# Altium schematic sheet Sheet1.SchDoc
size A
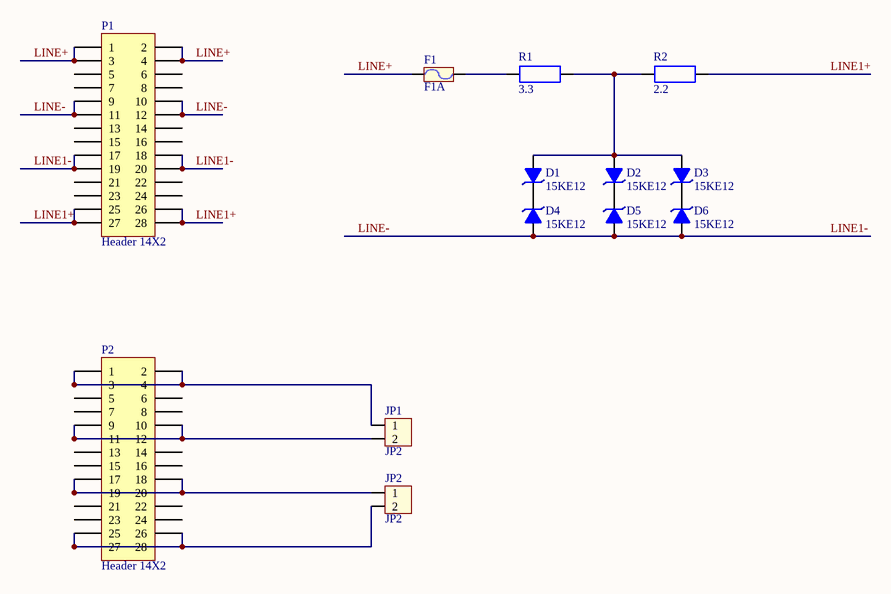
[diagram p0: Sheet1.SchDoc]

## Parts
D1  15KE12  [D1A]
D2  15KE12  [D1A]
D3  15KE12  [D1A]
D4  15KE12  [D1A]
D5  15KE12  [D1A]
D6  15KE12  [D1A]
F1  F1A  [Fuse]
JP1  JP2  [CON2]
JP2  JP2  [CON2]
P1  Header 14X2  [HDR2X14]
P2  Header 14X2  [HDR2X14]
R1  3.3  [R2W]
R2  2.2  [R2W]

## Nets
LINE1+: P1.25 P1.26 P1.27 P1.28 R2.2
LINE+: F1.1 P1.1 P1.2 P1.3 P1.4
LINE-: D4.1(A) D5.1(A) D6.1(A) P1.9 P1.10 P1.11 P1.12 P1.17 P1.18 P1.19 P1.20  [also labelled LINE1-]
NetD1_1: D1.1(A) D2.1(A) D3.1(A) R1.2 R2.1
NetD1_2: D1.2(K) D4.2(K)
NetD2_2: D2.2(K) D5.2(K)
NetD3_2: D3.2(K) D6.2(K)
NetF1_2: F1.2 R1.1
NetJP1_1: JP1.1 P2.1 P2.2 P2.3 P2.4
NetJP1_2: JP1.2 P2.9 P2.10 P2.11 P2.12
NetJP2_1: JP2.1 P2.17 P2.18 P2.19 P2.20
NetJP2_2: JP2.2 P2.25 P2.26 P2.27 P2.28

Not connected (* = marked no-connect by the designer): P1 5 6 7 8 13 14 15 16 21 22 23 24; P2 5 6 7 8 13 14 15 16 21 22 23 24

## Library data of the parts
D1-D6 = Zener
F1 = Fuse: Designed by: VanDungEvn; Value: Fuse
JP1 JP2 = Con2: Connector 2; Value: Connector 2
P1 P2 = Header 14X2: Header, 14-Pin, Dual row; LatestRevisionDate: 17-Jul-2002; LatestRevisionNote: Re-released for DXP Platform.; Publisher: Altium Limited
R1 R2 = R2W: Resistor 2W; Value: R2W - 47